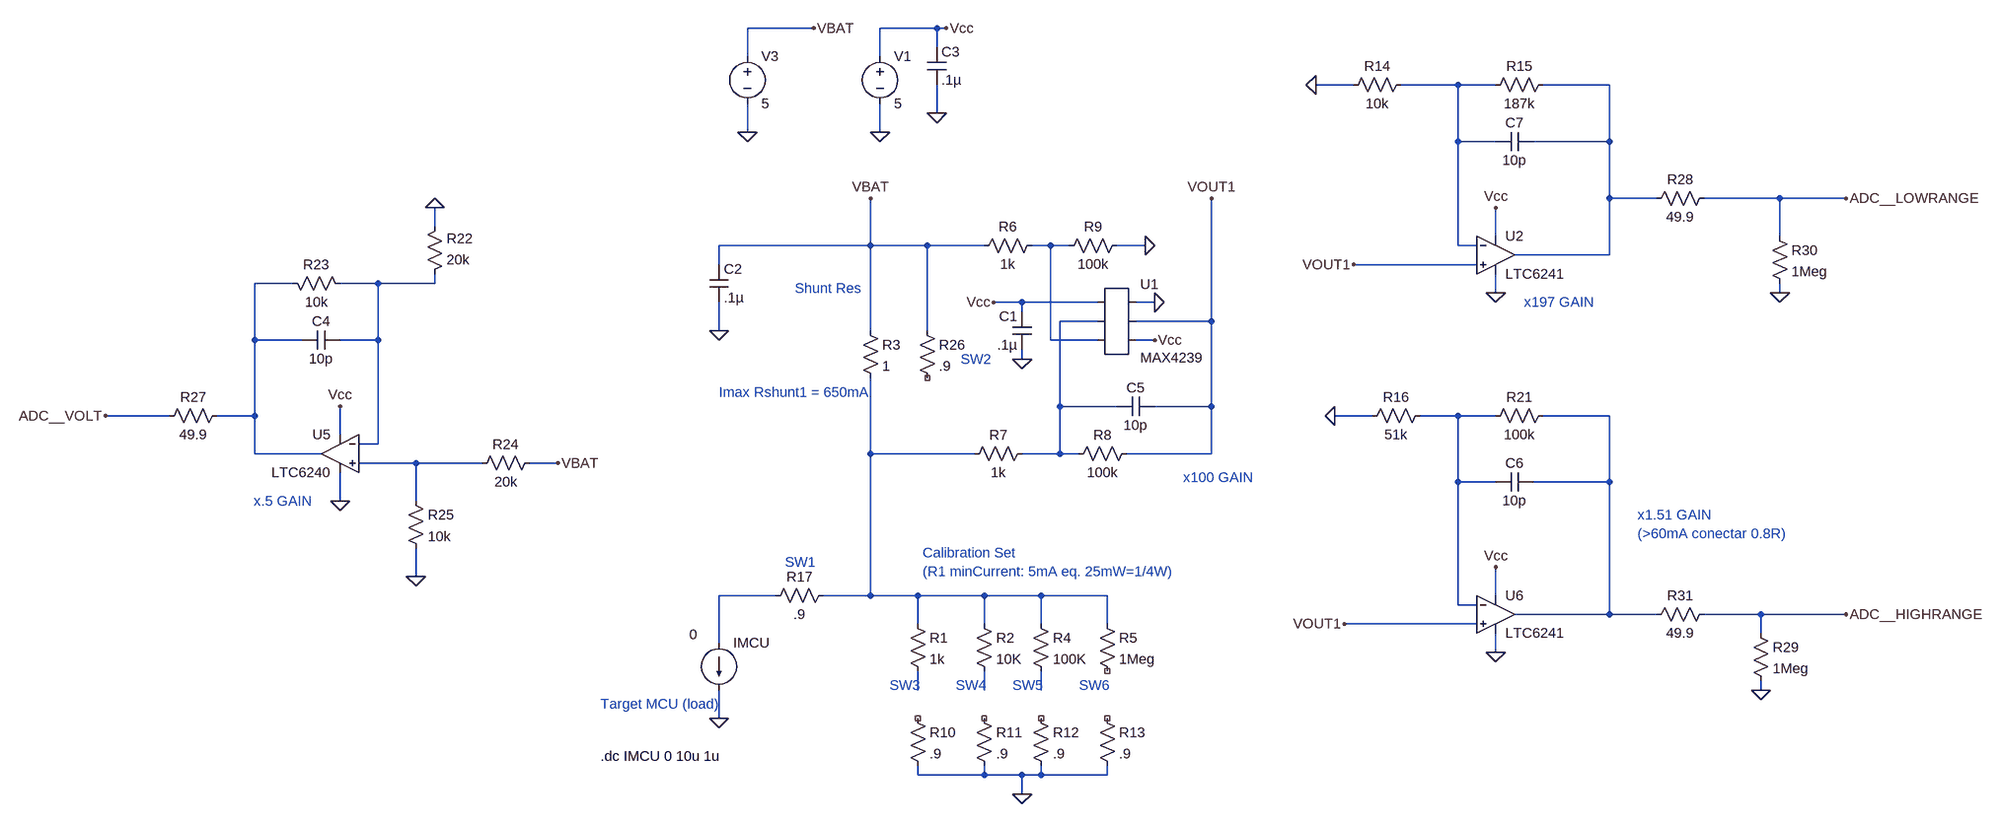
[diagram p0: schematic v3_max4239_lt624X.asc]
v3_max4239_lt624X.asc, the LTspice schematic file:
Version 4
SHEET 1 2752 996
WIRE -240 -432 -352 -432
WIRE -32 -432 -128 -432
WIRE -16 -432 -32 -432
WIRE -32 -400 -32 -432
WIRE -352 -384 -352 -432
WIRE -128 -384 -128 -432
WIRE 672 -336 608 -336
WIRE 848 -336 752 -336
WIRE 912 -336 848 -336
WIRE 1104 -336 992 -336
WIRE -32 -288 -32 -336
WIRE -352 -256 -352 -304
WIRE -128 -256 -128 -304
WIRE 848 -240 848 -336
WIRE 912 -240 848 -240
WIRE 1104 -240 1104 -336
WIRE 1104 -240 976 -240
WIRE 1104 -144 1104 -240
WIRE 1184 -144 1104 -144
WIRE 1392 -144 1264 -144
WIRE 1504 -144 1392 -144
WIRE -880 -96 -880 -128
WIRE 912 -80 912 -128
WIRE 1392 -80 1392 -144
WIRE -144 -64 -144 -144
WIRE -144 -64 -400 -64
WIRE -48 -64 -144 -64
WIRE 48 -64 -48 -64
WIRE 160 -64 128 -64
WIRE 192 -64 160 -64
WIRE 320 -64 272 -64
WIRE 848 -64 848 -240
WIRE 880 -64 848 -64
WIRE 1104 -48 1104 -144
WIRE 1104 -48 944 -48
WIRE -400 -32 -400 -64
WIRE 880 -32 672 -32
WIRE -1120 0 -1184 0
WIRE -976 0 -1040 0
WIRE -880 0 -880 -16
WIRE -880 0 -976 0
WIRE 912 16 912 -16
WIRE 1392 16 1392 0
WIRE 112 32 64 32
WIRE 240 32 112 32
WIRE 336 32 304 32
WIRE 112 48 112 32
WIRE 240 64 176 64
WIRE 432 64 432 -144
WIRE 432 64 304 64
WIRE -400 80 -400 32
WIRE -144 80 -144 -64
WIRE -48 80 -48 -64
WIRE -1184 96 -1184 0
WIRE -1104 96 -1184 96
WIRE -976 96 -976 0
WIRE -976 96 -1040 96
WIRE 160 96 160 -64
WIRE 240 96 160 96
WIRE 336 96 304 96
WIRE 112 128 112 112
WIRE 176 208 176 64
WIRE 272 208 176 208
WIRE 432 208 432 64
WIRE 432 208 336 208
WIRE -1328 224 -1488 224
WIRE -1184 224 -1184 96
WIRE -1184 224 -1248 224
WIRE 704 224 640 224
WIRE 848 224 784 224
WIRE 912 224 848 224
WIRE 1104 224 992 224
WIRE -1040 256 -1040 208
WIRE -976 272 -976 96
WIRE -976 272 -1008 272
WIRE -1184 288 -1184 224
WIRE -1072 288 -1184 288
WIRE -144 288 -144 160
WIRE 32 288 -144 288
WIRE 176 288 176 208
WIRE 176 288 112 288
WIRE 208 288 176 288
WIRE 432 288 432 208
WIRE 432 288 288 288
WIRE -912 304 -1008 304
WIRE -800 304 -912 304
WIRE -672 304 -720 304
WIRE 848 336 848 224
WIRE 912 336 848 336
WIRE 1104 336 1104 224
WIRE 1104 336 976 336
WIRE -1040 368 -1040 320
WIRE -912 368 -912 304
WIRE -912 496 -912 448
WIRE -304 528 -400 528
WIRE -144 528 -144 288
WIRE -144 528 -224 528
WIRE -64 528 -144 528
WIRE 48 528 -64 528
WIRE 144 528 48 528
WIRE 256 528 144 528
WIRE 912 528 912 480
WIRE 848 544 848 336
WIRE 880 544 848 544
WIRE 1104 560 1104 336
WIRE 1104 560 944 560
WIRE 1184 560 1104 560
WIRE 1360 560 1264 560
WIRE 1504 560 1360 560
WIRE -64 576 -64 528
WIRE 48 576 48 528
WIRE 144 576 144 528
WIRE 256 576 256 528
WIRE 880 576 656 576
WIRE 1360 592 1360 560
WIRE -400 608 -400 528
WIRE 912 624 912 592
WIRE -64 688 -64 656
WIRE 48 688 48 656
WIRE 144 688 144 656
WIRE 1360 688 1360 672
WIRE -400 736 -400 688
WIRE -64 832 -64 816
WIRE 48 832 48 816
WIRE 48 832 -64 832
WIRE 112 832 48 832
WIRE 144 832 144 816
WIRE 144 832 112 832
WIRE 256 832 256 816
WIRE 256 832 144 832
WIRE 112 864 112 832
FLAG -128 -256 0
FLAG -16 -432 Vcc
FLAG -32 -288 0
FLAG -352 -256 0
FLAG -240 -432 VBAT
FLAG -400 80 0
FLAG -400 736 0
FLAG 336 32 0
FLAG 432 -144 VOUT1
FLAG 336 96 Vcc
FLAG -144 -144 VBAT
FLAG 112 864 0
FLAG 64 32 Vcc
FLAG 320 -64 0
FLAG -1040 208 Vcc
FLAG -1040 368 0
FLAG -880 -128 0
FLAG -1488 224 ADC__VOLT
FLAG -912 496 0
FLAG -672 304 VBAT
FLAG 912 -128 Vcc
FLAG 912 16 0
FLAG 912 480 Vcc
FLAG 912 624 0
FLAG 640 224 0
FLAG 672 -32 VOUT1
FLAG 1504 -144 ADC__LOWRANGE
FLAG 1504 560 ADC__HIGHRANGE
FLAG 656 576 VOUT1
FLAG 608 -336 0
FLAG 1360 688 0
FLAG 1392 16 0
FLAG 112 128 0
SYMBOL voltage -128 -400 R0
WINDOW 123 0 0 Left 2
WINDOW 39 0 0 Left 2
SYMATTR InstName V1
SYMATTR Value 5
SYMBOL cap -48 -400 R0
SYMATTR InstName C3
SYMATTR Value .1µ
SYMBOL voltage -352 -400 R0
WINDOW 123 0 0 Left 2
WINDOW 39 0 0 Left 2
SYMATTR InstName V3
SYMATTR Value 5
SYMBOL cap -416 -32 R0
SYMATTR InstName C2
SYMATTR Value .1µ
SYMBOL res -160 64 R0
SYMATTR InstName R3
SYMATTR Value 1
SYMATTR SpiceLine tol=.01 pwr=100m
SYMBOL res 128 272 R90
WINDOW 0 0 56 VBottom 2
WINDOW 3 32 56 VTop 2
SYMATTR InstName R7
SYMATTR Value 1k
SYMATTR SpiceLine tol=.1 pwr=.05
SYMBOL res -80 560 R0
SYMATTR InstName R1
SYMATTR Value 1k
SYMATTR SpiceLine tol=.1
SYMBOL res 32 560 R0
SYMATTR InstName R2
SYMATTR Value 10K
SYMATTR SpiceLine tol=.1 pwr=.05
SYMBOL res 128 560 R0
SYMATTR InstName R4
SYMATTR Value 100K
SYMATTR SpiceLine tol=.1
SYMBOL res 240 560 R0
SYMATTR InstName R5
SYMATTR Value 1Meg
SYMATTR SpiceLine tol=.1
SYMBOL AutoGenerated\\MAX4239 272 64 R0
SYMATTR InstName U1
SYMBOL cap 128 112 R180
WINDOW 0 24 56 Left 2
WINDOW 3 24 8 Left 2
SYMATTR InstName C1
SYMATTR Value .1µ
SYMBOL res 304 272 R90
WINDOW 0 0 56 VBottom 2
WINDOW 3 32 56 VTop 2
SYMATTR InstName R8
SYMATTR Value 100k
SYMBOL res 144 -80 R90
WINDOW 0 0 56 VBottom 2
WINDOW 3 32 56 VTop 2
SYMATTR InstName R6
SYMATTR Value 1k
SYMATTR SpiceLine tol=.1 pwr=.05
SYMBOL res 288 -80 R90
WINDOW 0 0 56 VBottom 2
WINDOW 3 32 56 VTop 2
SYMATTR InstName R9
SYMATTR Value 100k
SYMBOL res -64 64 R0
SYMATTR InstName R26
SYMATTR Value .9
SYMATTR SpiceLine tol=1 pwr=180m
SYMBOL res -896 0 M180
WINDOW 0 36 76 Left 2
WINDOW 3 36 40 Left 2
SYMATTR InstName R22
SYMATTR Value 20k
SYMATTR SpiceLine tol=.1
SYMBOL res -1136 -16 M90
WINDOW 0 0 56 VBottom 2
WINDOW 3 32 56 VTop 2
SYMATTR InstName R23
SYMATTR Value 10k
SYMATTR SpiceLine tol=.1 pwr=.05
SYMBOL res -704 288 R90
WINDOW 0 0 56 VBottom 2
WINDOW 3 32 56 VTop 2
SYMATTR InstName R24
SYMATTR Value 20k
SYMATTR SpiceLine tol=.1
SYMBOL res -928 352 R0
SYMATTR InstName R25
SYMATTR Value 10k
SYMATTR SpiceLine tol=.1 pwr=.05
SYMBOL Opamps\\LTC6240 -1040 288 M0
SYMATTR InstName U5
SYMBOL cap -1040 80 R90
WINDOW 0 0 32 VBottom 2
WINDOW 3 32 32 VTop 2
SYMATTR InstName C4
SYMATTR Value 10p
SYMBOL res -1232 208 R90
WINDOW 0 0 56 VBottom 2
WINDOW 3 32 56 VTop 2
SYMATTR InstName R27
SYMATTR Value 49.9
SYMATTR SpiceLine tol=1 pwr=.05
SYMBOL cap 336 192 R90
WINDOW 0 0 32 VBottom 2
WINDOW 3 32 32 VTop 2
SYMATTR InstName C5
SYMATTR Value 10p
SYMBOL res 768 -352 R90
WINDOW 0 0 56 VBottom 2
WINDOW 3 32 56 VTop 2
SYMATTR InstName R14
SYMATTR Value 10k
SYMATTR SpiceLine tol=1 pwr=.05
SYMBOL res 1008 -352 R90
WINDOW 0 0 56 VBottom 2
WINDOW 3 32 56 VTop 2
SYMATTR InstName R15
SYMATTR Value 187k
SYMATTR SpiceLine tol=.1
SYMBOL res 800 208 R90
WINDOW 0 0 56 VBottom 2
WINDOW 3 32 56 VTop 2
SYMATTR InstName R16
SYMATTR Value 51k
SYMATTR SpiceLine tol=.1
SYMBOL res 1008 208 R90
WINDOW 0 0 56 VBottom 2
WINDOW 3 32 56 VTop 2
SYMATTR InstName R21
SYMATTR Value 100k
SYMATTR SpiceLine tol=.1
SYMBOL Opamps\\LTC6241 912 -48 R0
SYMATTR InstName U2
SYMBOL Opamps\\LTC6241 912 560 R0
SYMATTR InstName U6
SYMBOL cap 976 320 R90
WINDOW 0 0 32 VBottom 2
WINDOW 3 32 32 VTop 2
SYMATTR InstName C6
SYMATTR Value 10p
SYMBOL cap 976 -256 R90
WINDOW 0 0 32 VBottom 2
WINDOW 3 32 32 VTop 2
SYMATTR InstName C7
SYMATTR Value 10p
SYMBOL res 1280 -160 R90
WINDOW 0 0 56 VBottom 2
WINDOW 3 32 56 VTop 2
SYMATTR InstName R28
SYMATTR Value 49.9
SYMATTR SpiceLine tol=1 pwr=.05
SYMBOL res 1344 576 R0
SYMATTR InstName R29
SYMATTR Value 1Meg
SYMBOL res 1376 -96 R0
SYMATTR InstName R30
SYMATTR Value 1Meg
SYMBOL res 1280 544 R90
WINDOW 0 0 56 VBottom 2
WINDOW 3 32 56 VTop 2
SYMATTR InstName R31
SYMATTR Value 49.9
SYMATTR SpiceLine tol=1 pwr=.05
SYMBOL current -400 608 R0
WINDOW 123 0 0 Left 2
WINDOW 39 0 0 Left 2
WINDOW 3 -50 -14 Left 2
SYMATTR Value 0
SYMATTR InstName IMCU
SYMBOL res -80 720 R0
SYMATTR InstName R10
SYMATTR Value .9
SYMBOL res 32 720 R0
SYMATTR InstName R11
SYMATTR Value .9
SYMBOL res 128 720 R0
SYMATTR InstName R12
SYMATTR Value .9
SYMBOL res 240 720 R0
SYMATTR InstName R13
SYMATTR Value .9
SYMBOL res -208 512 R90
WINDOW 0 0 56 VBottom 2
WINDOW 3 32 56 VTop 2
SYMATTR InstName R17
SYMATTR Value .9
TEXT 384 328 Left 2 ;x100 GAIN
TEXT -56 456 Left 2 ;Calibration Set\n(R1 minCurrent: 5mA eq. 25mW=1/4W)
TEXT -600 712 Left 2 ;Target MCU (load)
TEXT -272 8 Left 2 ;Shunt Res
TEXT -288 472 Left 2 ;SW1
TEXT 8 128 Left 2 ;SW2
TEXT -112 680 Left 2 ;SW3
TEXT 0 680 Left 2 ;SW4
TEXT 96 680 Left 2 ;SW5
TEXT 208 680 Left 2 ;SW6
TEXT -1088 368 Right 2 ;x.5 GAIN
TEXT 960 32 Left 2 ;x197 GAIN
TEXT 1152 392 Left 2 ;x1.51 GAIN\n(>60mA conectar 0.8R)
TEXT -600 800 Left 2 !.dc IMCU 0 10u 1u
TEXT -400 184 Left 2 ;Imax Rshunt1 = 650mA

The netlist it stands for:
* v3_max4239_lt624X.asc
V1 Vcc 0 5
C3 Vcc 0 .1µ
V3 VBAT 0 5
C2 VBAT 0 .1µ
R3 VBAT N009 1 tol=.01 pwr=100m
R7 N006 N009 1k tol=.1 pwr=.05
R1 N009 N012 1k tol=.1
R2 N009 N013 10K tol=.1 pwr=.05
R4 N009 N014 100K tol=.1
R5 N009 NC_01 1Meg tol=.1
* U1: MAX4239 (symbol AutoGenerated\MAX4239 not available, pins judged from their places): pin1=Vcc pin2=N006 pin3=N003 pin4=0 pin5=VOUT1 pin6=Vcc
C1 0 Vcc .1µ
R8 VOUT1 N006 100k
R6 N003 VBAT 1k tol=.1 pwr=.05
R9 0 N003 100k
R26 VBAT NC_02 .9 tol=1 pwr=180m
R22 N005 0 20k tol=.1
R23 N004 N005 10k tol=.1 pwr=.05
R24 VBAT N010 20k tol=.1
R25 N010 0 10k tol=.1 pwr=.05
* U5: LTC6240 (symbol Opamps\LTC6240 not available, pins judged from their places): In+=N010 In-=N005 V+=Vcc V-=0 OUT=N004
C4 N005 N004 10p
R27 N004 ADC__VOLT 49.9 tol=1 pwr=.05
C5 VOUT1 N006 10p
R14 N001 0 10k tol=1 pwr=.05
R15 N002 N001 187k tol=.1
R16 N007 0 51k tol=.1
R21 N008 N007 100k tol=.1
XU2 VOUT1 N001 Vcc 0 N002 LTC6241  ; pins In+ In- V+ V- OUT
XU6 VOUT1 N007 Vcc 0 N008 LTC6241  ; pins In+ In- V+ V- OUT
C6 N008 N007 10p
C7 N002 N001 10p
R28 ADC__LOWRANGE N002 49.9 tol=1 pwr=.05
R29 ADC__HIGHRANGE 0 1Meg
R30 ADC__LOWRANGE 0 1Meg
R31 ADC__HIGHRANGE N008 49.9 tol=1 pwr=.05
IMCU N011 0 0
R10 NC_03 0 .9
R11 NC_04 0 .9
R12 NC_05 0 .9
R13 NC_06 0 .9
R17 N009 N011 .9
* x100 GAIN
* Calibration Set
* (R1 minCurrent: 5mA eq. 25mW=1/4W)
* Target MCU (load)
* Shunt Res
* SW1
* SW2
* SW3
* SW4
* SW5
* SW6
* x.5 GAIN
* x197 GAIN
* x1.51 GAIN
* (>60mA conectar 0.8R)
.dc IMCU 0 10u 1u
* Imax Rshunt1 = 650mA
.lib LTC4.lib
.backanno
.end